# EAGLE design APM_BLE (EAGLE 7.5.0)
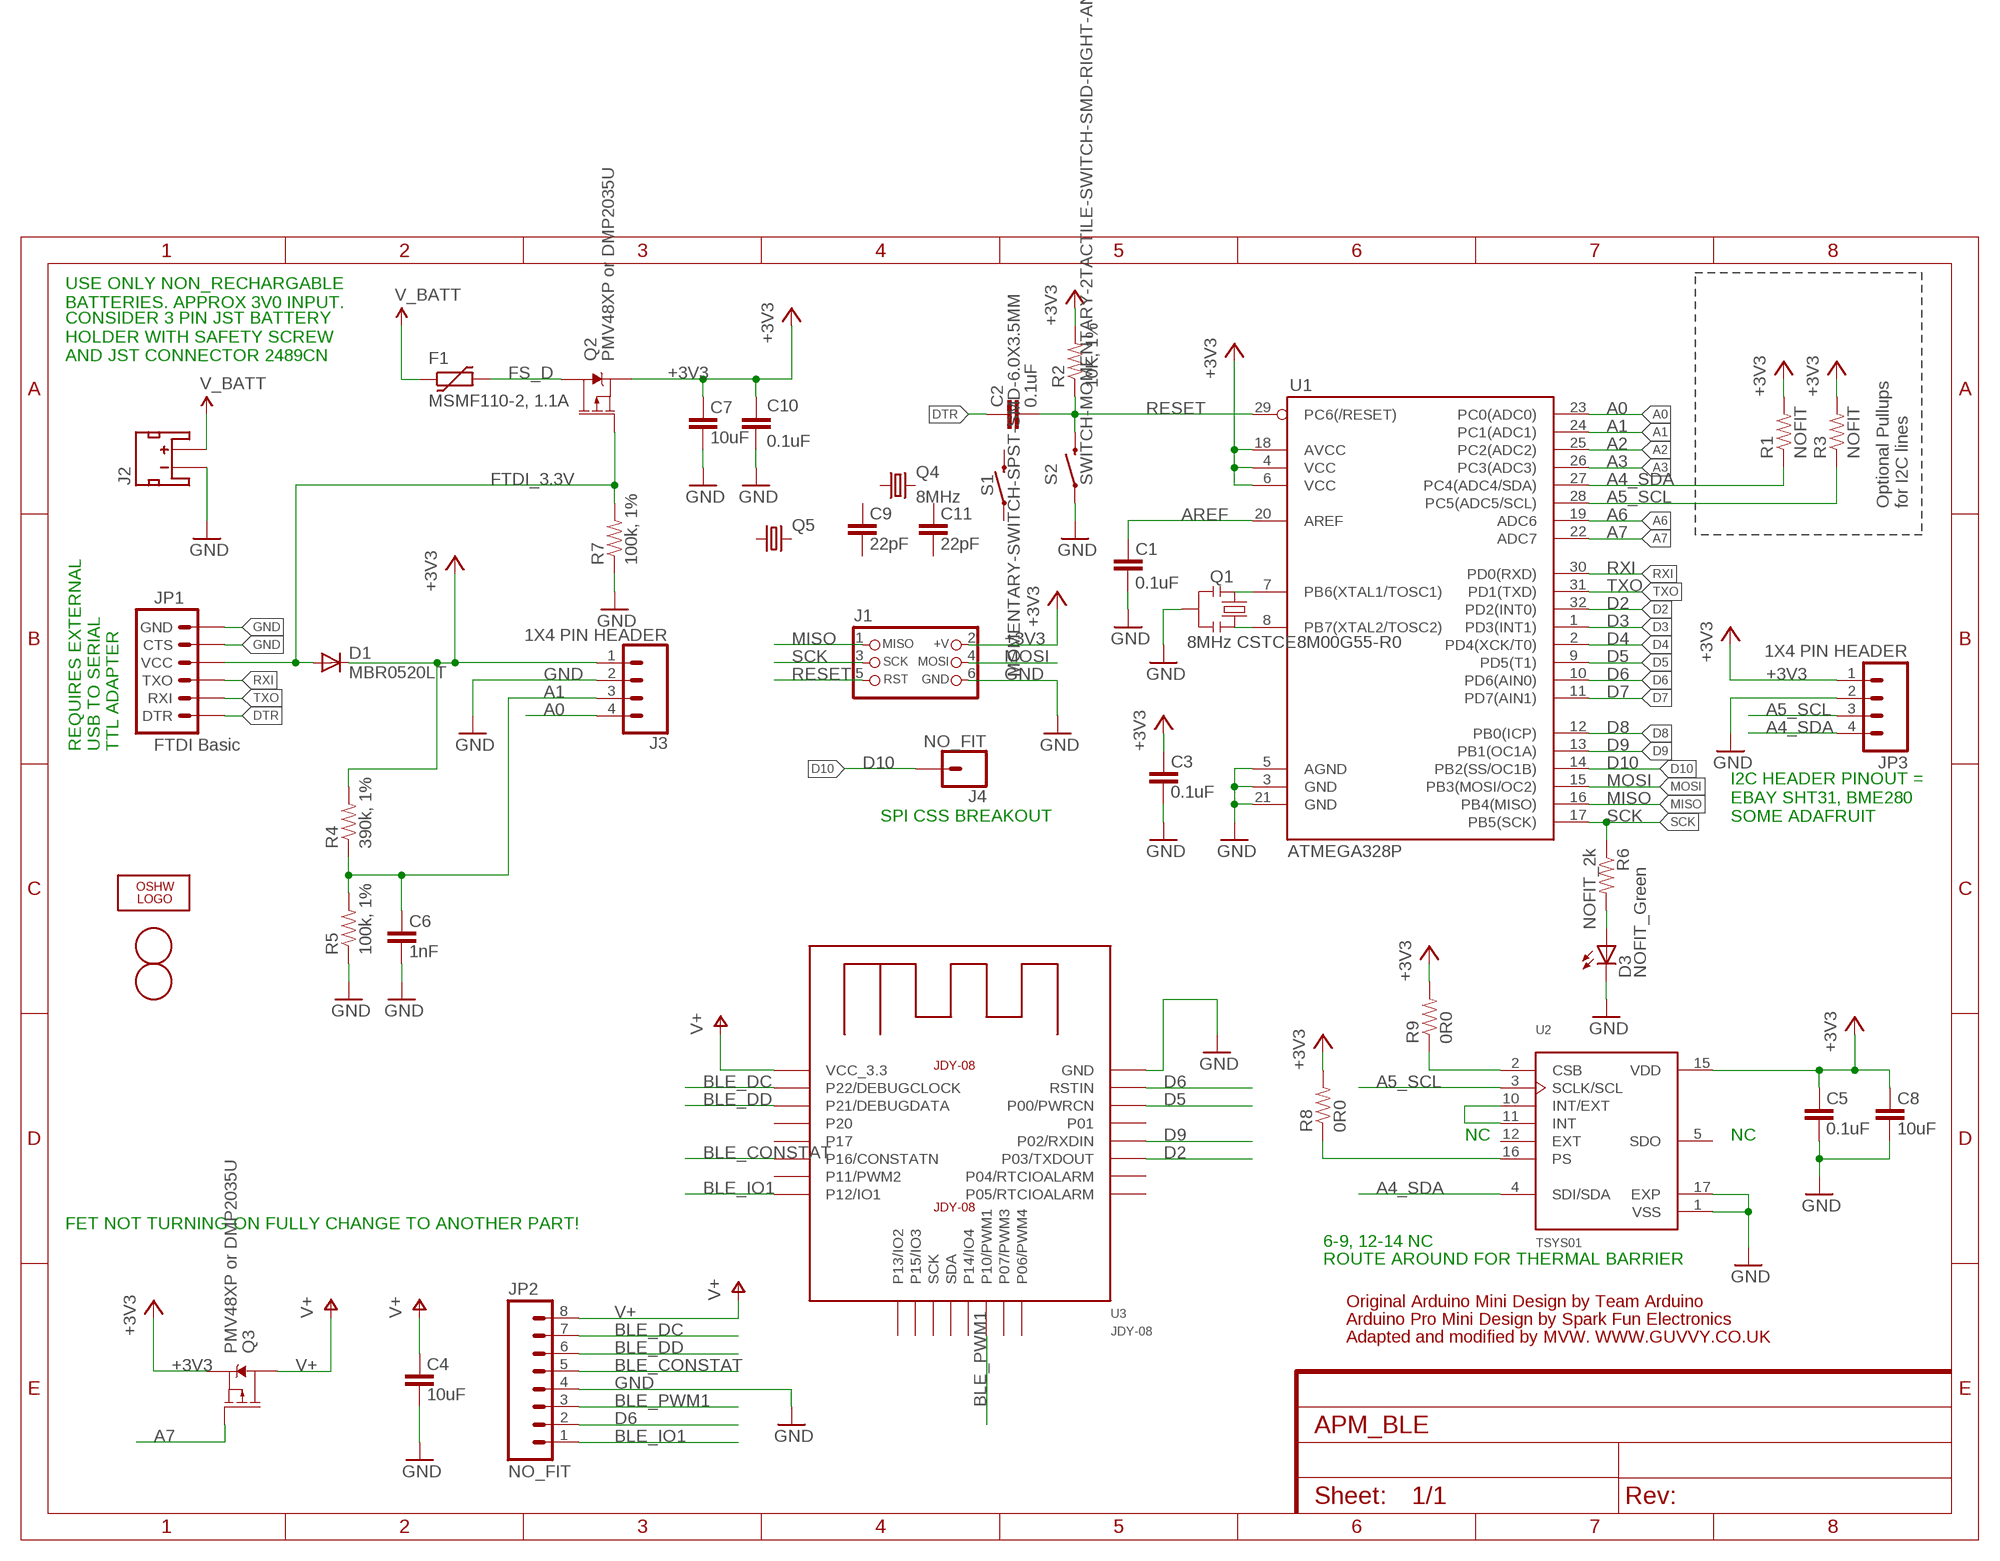
[diagram p0: schematic, sheet 1]

## Parts
C1  0.1uF  CAP0603-CAP  [0603-CAP]
C2  0.1uF  CAP0603-CAP  [0603-CAP]
C3  0.1uF  CAP0603-CAP  [0603-CAP]
C4  10uF  CAP0603-CAP  [0603-CAP]
C5  0.1uF  CAP0603-CAP  [0603-CAP]
C6  1nF  CAP0603-CAP  [0603-CAP]
C7  10uF  CAP0603-CAP  [0603-CAP]
C8  10uF  CAP0603-CAP  [0603-CAP]
C9  22pF  CAP0603-CAP  [0603-CAP]
C10  0.1uF  CAP0603-CAP  [0603-CAP]
C11  22pF  CAP0603-CAP  [0603-CAP]
D1  MBR0520LT  [SOD123]
D3  NOFIT_Green  LED  [0603-LED-ALT1]
F1  MSMF110-2, 1.1A  FUSE_PTC-1812  [PTC1812L]
FID1  FIDUCIAL  [FIDUCIAL_1MM]
FID2  FIDUCIAL  [FIDUCIAL_1MM]
J1  CON_HEADER_PRG_AVR_ICSP-PTH  [HEADER_PRG_2X03]
J2  S2B-PH-SM4-TB(LF)(SN)  JST_2MM_MALE  [JST-2-SMD]
J3  1X4 PIN HEADER  CONN_04  [1X04]
J4  NO_FIT  CONN_01  [1X01]
JP1  FTDI Basic  ARDUINO_SERIAL_PROGRAMPTH  [1X06]
JP2  NO_FIT  M08BM08B-SRSS-TB  [BM08B-SRSS-TB]
JP3  1X4 PIN HEADER  M04PTH  [1X04]
LOGO1  OSHW_LOGO_FILLX0200-NT  [OSHW_FILLX200_NOTEXT]
Q1  8MHz CSTCE8M00G55-R0  RESONATOR1:1  [RESONATOR-SMD-1:1]
Q2  PMV48XP or DMP2035U  MOSFET_PCH-IRLML2244  [SOT23-3]
Q3  PMV48XP or DMP2035U  MOSFET_PCH-IRLML2244  [SOT23-3]
Q4  8MHz  CRYSTALHC49UP  [HC49UP]
Q5  CRYSTALCTS406  [CTS406]
R1  NOFIT  RESISTOR0603-RES  [0603-RES]
R2  10K, 1%  RESISTOR0603-RES  [0603-RES]
R3  NOFIT  RESISTOR0603-RES  [0603-RES]
R4  390k, 1%  RESISTOR0603-RES  [0603-RES]
R5  100k, 1%  RESISTOR0603-RES  [0603-RES]
R6  NOFIT_2k  RESISTOR0603-RES  [0603-RES]
R7  100k, 1%  RESISTOR0603-RES  [0603-RES]
R8  0R0  RESISTOR0603-RES  [0603-RES]
R9  0R0  RESISTOR0603-RES  [0603-RES]
S1  MOMENTARY-SWITCH-SPST-SMD-6.0X3.5MM  [TACTILE_SWITCH_SMD_6.0X3.5MM]
S2  SWITCH-MOMENTARY-2TACTILE-SWITCH-SMD-RIGHT-ANGLE  [TACTILE_SWITCH-SMD-RIGHT-ANGLE]
U1  ATMEGA328P  ATMEGA168  [TQFP32-08]
U2  TSYS01  [QFN65P400X400X90-17N]
U3  JDY-08  JDY-08JDY-08_MODULE  [JDY-08]

## Nets
+3V3: C3.2 C5.2 C7.2 C8.2 C10.1 D1.C J1.2(+V) J3.1 JP3.1 Q2.2(S) Q3.2(S) R1.2 R2.2 R3.2 R4.2 R8.2 R9.2 U1.4(VCC) U1.6(VCC) U1.18(AVCC) U2.15(VDD)
A0: J3.4 U1.23(PC0(ADC0))
A1: C6.2 J3.3 R4.1 R5.2 U1.24(PC1(ADC1))
A2: U1.25(PC2(ADC2))
A3: U1.26(PC3(ADC3))
A4_SDA: JP3.4 R1.1 U1.27(PC4(ADC4/SDA)) U2.4(SDI/SDA)
A5_SCL: JP3.3 R3.1 U1.28(PC5(ADC5/SCL)) U2.3(SCLK/SCL)
A6: U1.19(ADC6)
A7: Q3.1(G) U1.22(ADC7)
AREF: C1.2 U1.20(AREF)
BLE_CONSTAT: JP2.5 U3.6(P16/CONSTATN)
BLE_DC: JP2.7 U3.2(P22/DEBUGCLOCK)
BLE_DD: JP2.6 U3.3(P21/DEBUGDATA)
BLE_IO1: JP2.1 U3.8(P12/IO1)
BLE_PWM1: JP2.3 U3.14(P10/PWM1)
D2: U1.32(PD2(INT0)) U3.19(P03/TXDOUT)
D3: U1.1(PD3(INT1))
D4: U1.2(PD4(XCK/T0))
D5: U1.9(PD5(T1)) U3.22(P00/PWRCN)
D6: JP2.2 U1.10(PD6(AIN0)) U3.23(RSTIN)
D7: U1.11(PD7(AIN1))
D8: U1.12(PB0(ICP))
D9: U1.13(PB1(OC1A)) U3.20(P02/RXDIN)
D10: J4.1 U1.14(PB2(SS/OC1B))
DTR: C2.2 JP1.1(DTR)
FS_D: F1.2 Q2.3(D)
FTDI_3.3V [vcc]: D1.A JP1.4(VCC) Q2.1(G) R7.2
GND [vcc]: C1.1 C3.1 C4.1 C5.1 C6.1 C7.1 C8.1 C10.2 D3.C J1.6(GND) J2.1(-) J3.2 JP1.5(CTS) JP1.6(GND) JP2.4 JP3.2 Q1.2 R5.1 R7.1 S2.1 U1.3(GND) U1.5(AGND) U1.21(GND) U2.1(VSS) U2.17(EXP) U3.24(GND)
MISO: J1.1(MISO) U1.16(PB4(MISO))
MOSI: J1.4(MOSI) U1.15(PB3(MOSI/OC2))
N$1: Q1.3 U1.8(PB7(XTAL2/TOSC2))
N$2: Q1.1 U1.7(PB6(XTAL1/TOSC1))
N$4: R9.1 U2.2(CSB)
N$6: U2.10(INT/EXT) U2.11(INT)
N$7: D3.A R6.2
N$10: R8.1 U2.16(PS)
RESET: C2.1 J1.5(RST) R2.1 S2.2 U1.29(PC6(/RESET))
RXI: JP1.3(TXO) U1.30(PD0(RXD))
SCK: J1.3(SCK) R6.1 U1.17(PB5(SCK))
TXO: JP1.2(RXI) U1.31(PD1(TXD))
V+: C4.2 JP2.8 Q3.3(D) U3.1(VCC_3.3)
V_BATT: F1.1 J2.2(+)
Unconnected: C9.1 C9.2 C11.1 C11.2 J2.NC1(PAD1) J2.NC2(PAD2) Q4.1 Q4.2 Q5.1 Q5.3 S1.1 S1.2 U2.5(SDO) U2.12(EXT) U3.4(P20) U3.5(P17) U3.7(P11/PWM2) U3.9(P13/IO2) U3.10(P15/IO3) U3.11(SCK) U3.12(SDA) U3.13(P14/IO4) U3.15(P07/PWM3) U3.16(P06/PWM4) U3.17(P05/RTCIOALARM) U3.18(P04/RTCIOALARM) U3.21(P01)

## Notes on the sheet
- USE ONLY NON_RECHARGABLE
  BATTERIES. APPROX 3V0 INPUT.
- CONSIDER 3 PIN JST BATTERY 
  HOLDER WITH SAFETY SCREW 
  AND JST CONNECTOR 2489CN
- Optional Pullups 
  for I2C lines
- REQUIRES EXTERNAL 
  USB TO SERIAL 
  TTL ADAPTER
- SPI CSS BREAKOUT
- I2C HEADER PINOUT = 
  EBAY SHT31, BME280
  SOME ADAFRUIT
- NC | NC
- FET NOT TURNING ON FULLY CHANGE TO ANOTHER PART!
- 6-9, 12-14 NC
- ROUTE AROUND FOR THERMAL BARRIER
- Original Arduino Mini Design by Team Arduino
- Arduino Pro Mini Design by Spark Fun Electronics
- Adapted and modified by MVW. WWW.GUVVY.CO.UK

## Library data of the parts
C1-C11 = SparkFun:CAP: Capacitor Standard 0603 ceramic capacitor, and 0.1" leaded capacitor.; OC_FARNELL: unknown
D1 = diode:MBR0520LT: SCHOTTKY BARRIER RECTIFIER Source: http://onsemi.com .. MBR0520LT1-D.pdf; OC_FARNELL: unknown
D3 = Testing:LED: LEDs Standard schematic elements and footprints for 5mm, 3mm, 1206, and 0603 sized LEDs. 5mm - Spark Fun Electronics SKU : COM-00529 (and others); OC_FARNELL: unknown
F1 = dp_devices:FUSE_PTC: Resettable PTC; MF: BOURNS; MPN: MF-MSMF110-2; OC_FARNELL: 9350330
FID1 FID2 = adafruit:FIDUCIAL: For use by pick and place machines to calibrate the vision/machine, 1mm By microbuilder.eu; OC_FARNELL: unknown
J1 = dp_devices:CON_HEADER_PRG_AVR_ICSP: 2x3 AVR ICSP programming header; OC_FARNELL: unknown
J2 = SparkFun-Connectors:JST_2MM_MALE: JST 2MM MALE RA CONNECTOR Two pin, compact surface mount connector. Commonly used as a battery input connection point. We really like the solid locking feeling and high current rating on these small connectors. We use these all the time as battery connectors. Mates to single-cell LiPo batteries. Here is the connector we sell at SparkFun: JST Right Angle Connector - White <https://www.sparkfun.com/products/8612> (PRT-08612) Datasheet <http://www.sparkfun.com/datasheets/Prototyping/Connectors/JST-Horizontal.pdf> It was used on these SparkFun products: SparkFun MOSFET Power Controller <https://www.sparkfun.com/products/11214> (PRT-11214) SparkFun Battery Babysitter - LiPo Battery Manager <https://www.sparkfun.com/products/13777> (PRT-13777) And many, many others that required a lipo battery connection.; MF: JST (JAPAN SOLDERLESS TERMINALS); MPN: S2B-PH-SM4-TB(LF)(SN); OC_FARNELL: 9492615; PROD_ID: CONN-11443; SF_ID: PRT-08612
J3 = SparkFun-Connectors:CONN_04: Multi connection point. Often used as Generic Header-pin footprint for 0.1 inch spaced/style header connections On any of the 0.1 inch spaced packages, you can populate with these: Break Away Headers - Straight <https://www.sparkfun.com/products/116> (PRT-00116) Break Away Male Headers - Right Angle <https://www.sparkfun.com/products/553> (PRT-00553) Female Headers <https://www.sparkfun.com/products/115> (PRT-00115) Break Away Headers - Machine Pin <https://www.sparkfun.com/products/117> (PRT-00117) Break Away Female Headers - Swiss Machine Pin <https://www.sparkfun.com/products/743> (PRT-00743) For SCREWTERMINALS and SPRING TERMINALS visit here: Screw Terimnals on SparkFun.com <https://www.sparkfun.com/search/results?term=Screw+Terminals> (5mm/3.5mm/2.54mm spacing) This device is also useful as a general connection point to wire up your design to another part of your project. Our various solder wires solder well into these plated through hole pads. Hook-Up Wire - Assortment (Stranded, 22 AWG) <https://www.sparkfun.com/products/11375> (PRT-11375) Hook-Up Wire - Assortment (Solid Core, 22 AWG) <https://www.sparkfun.com/products/11367> (PRT-11367) View the entire wire category on our website here <https://www.sparkfun.com/categories/141> Special notes: Molex polarized connector foot print use with SKU : PRT-08231 with associated crimp pins and housings. 1MM SMD Version SKU: PRT-10208; OC_FARNELL: unknown; PROD_ID: CONN-09696
J4 = SparkFun-Connectors:CONN_01: Single connection point. Often used as Generic Header-pin footprint for 0.1 inch spaced/style header connections On any of the 0.1 inch spaced packages, you can populate with these: Break Away Headers - Straight <https://www.sparkfun.com/products/116> (PRT-00116) Break Away Male Headers - Right Angle <https://www.sparkfun.com/products/553> (PRT-00553) Female Headers <https://www.sparkfun.com/products/115> (PRT-00115) Break Away Headers - Machine Pin <https://www.sparkfun.com/products/117> (PRT-00117) Break Away Female Headers - Swiss Machine Pin <https://www.sparkfun.com/products/743> (PRT-00743) This device is also useful as a general connection point to wire up your design to another part of your project. Our various solder wires solder well into these plated through hole pads. Hook-Up Wire - Assortment (Stranded, 22 AWG) <https://www.sparkfun.com/products/11375> (PRT-11375) Hook-Up Wire - Assortment (Solid Core, 22 AWG) <https://www.sparkfun.com/products/11367> (PRT-11367) View the entire wire category on our website here <https://www.sparkfun.com/categories/141> Special notes: SMTSO-256-ET is a "flush mount" nut for a 4-40 screw. We mostly use this on specialty testbeds; it is a nice way to connect hardware to your PCB at an adjustable hieght. Also note, the SNAP packages are for using a snappable style connector. We sell a baggie of snaps and they are also used on two LilyPad designs: Snap Assortment - 30 pack (male and female) <https://www.sparkfun.com/products/11347> (DEV-11347) LilyPad Arduino SimpleSnap <https://www.sparkfun.com/products/10941> (DEV-10941) LilyPad SimpleSnap Protoboard <https://www.sparkfun.com/products/10940> (DEV-10940); OC_FARNELL: unknown
JP1 = SparkFun:ARDUINO_SERIAL_PROGRAM; OC_FARNELL: unknown
JP2 = SparkFun-Connectors:M08: Header 8 Standard 8-pin 0.1" header. Use with straight break away headers (SKU : PRT-00116), right angle break away headers (PRT-00553), swiss pins (PRT-00743), machine pins (PRT-00117), and female headers (PRT-00115).; OC_FARNELL: unknown
JP3 = BC9VPC_ShortenedSilkScreen:M04: Header 4 Standard 4-pin 0.1" header. Use with straight break away headers (SKU : PRT-00116), right angle break away headers (PRT-00553), swiss pins (PRT-00743), machine pins (PRT-00117), and female headers (PRT-00115). Molex polarized connector foot print use with SKU : PRT-08231 with associated crimp pins and housings. 1MM SMD Version SKU: PRT-10208; OC_FARNELL: unknown
LOGO1 = ohw-logo:OSHW_LOGO_FILL; OC_FARNELL: unknown
Q1 = Testing:RESONATOR: Resonator Small SMD resonator. This is the itty bitty 10/20MHz resonators with built in caps. CSTCE10M0G55 and CSTCE20M0V53. Footprint for SMD has been used in SFE production for years, and does work okay. 1:1 is an attempt to get larger fillets on the sides so it will be easier to inspect these solders in our AOI machine. The pads have been minimized to match the actual metal under the resonator. To see this relation, it includes an image import of the bottom side of the component. Imported to scale on layer 200.; MF: MURATA; MPN: CSTCE8M00G55-R0; OC_FARNELL: 2443270
Q2 Q3 = SparkFun-DiscreteSemi:MOSFET_PCH: P-channel MOSFETs Voltage controlled devices that allow control of high current outputs. SparkFun Products: SparkFun ESP32 Thing <https://www.sparkfun.com/products/13907> SparkFun ESP8266 Thing <https://www.sparkfun.com/products/13231>; MF: DIODES INC.; MPN: DMP2035U; OC_FARNELL: 2061419; PROD_ID: TRANS-11153; VALUE: 4.3A/20V/54mΩ
Q4 = adafruit:CRYSTAL: CRYSTAL; OC_FARNELL: unknown; OC_NEWARK: unknown
Q5 = crystal:CRYSTAL: CRYSTAL; OC_FARNELL: unknown; OC_NEWARK: unknown
R1-R9 = SparkFun:RESISTOR: Resistor Basic schematic elements and footprints for 0603, 1206, and PTH resistors.; OC_FARNELL: unknown
S1 = SparkFun-Switches:MOMENTARY-SWITCH-SPST: Momentary Switch (Pushbutton) - SPST Normally-open (NO) SPST momentary switches (buttons, pushbuttons). Variants PTH-12MM - 12mm square, through-hole Momentary Pushbutton Switch - 12mm Square <https://www.sparkfun.com/products/9190> (COM-09190) PTH-6.0MM, PTH-6.0MM-KIT - 6.0mm square, through-hole Mini Pushbutton Switch <https://www.sparkfun.com/products/97> (COM-00097) KIT package intended for soldering kit's - only one side of pads' copper is exposed. PTH-RIGHT-ANGLE-KIT - Right-angle, through-hole Right Angle Tactile Button <https://www.sparkfun.com/products/10791> - Used on SparkFun BigTime Watch Kit <https://www.sparkfun.com/products/11734> SMD-12MM - 12mm square, surface-mount Tactile Button - SMD (12mm) <https://www.sparkfun.com/products/12993> (COM-12993) Used on SparkFun PicoBoard <https://www.sparkfun.com/products/11888> SMD-4.5MM - 4.5mm Square Trackball Switch Used on SparkFun Blackberry Trackballer Breakout <https://www.sparkfun.com/products/13169> SMD-4.6MMX2.8MM - 4.60mm x 2.80mm, surface mount Used on SparkFun SAMD21 Mini Breakout <https://www.sparkfun.com/products/13664> SMD-5.2MM, SMD-5.2-REDUNDANT - 5.2mm square, surface-mount Mini Pushbutton Switch - SMD <https://www.sparkfun.com/products/8720> (COM-08720) Used on Arduino Pro Mini <https://www.sparkfun.com/products/11114> REDUNDANT package connects both switch circuits together SMD-6.0X3.5MM - 6.0 x 3.5mm, surface mount Momentary Reset Switch SMD <https://www.sparkfun.com/products/8229> (COM-08229) SMD-6.2MM-TALL - 6.2mm square, surface mount Tactile Button - SMD (6mm) <https://www.sparkfun.com/products/12992> Used on SparkFun Digital Sandbox <https://www.sparkfun.com/products/12651> SMD-RIGHT-ANGLE - Right-angle, surface mount Used on SparkFun Block for Intel® Edison - Arduino <https://www.sparkfun.com/products/13036>; OC_FARNELL: unknown; PROD_ID: SWCH-00815; SF_SKU: COM-08229
S2 = SparkFun-Electromechanical:SWITCH-MOMENTARY-2: Various NO switches- pushbuttons, reed, etc; OC_FARNELL: unknown; PROD_ID: COMP-12265
U1 = SparkFun:ATMEGA168; MF: MICROCHIP; MPN: ATMEGA328P-AU; OC_FARNELL: 1715486
U2 = TSYS01:TSYS01: TSYS01 Series 3.6 V - 40 C to + 125 C SMT Digital Temperature Sensor - QFN-16; AVAILABILITY: Warning; DESCRIPTION: TSYS01 Series 3.6 V - 40 C to + 125 C SMT Digital Temperature Sensor - QFN-16; MP: TSYS01; OC_FARNELL: unknown; PACKAGE: QFN-16 TE Connectivity; PRICE: 7.86 USD
U3 = JDY-08:JDY-08: JDY-08 Bluetooth 4.0 Transceiver based on TI CC2540/CC2541; OC_FARNELL: unknown

## Net classes
0 default: width 0.203 mm
1 vcc: width 0.254 mm

## Board
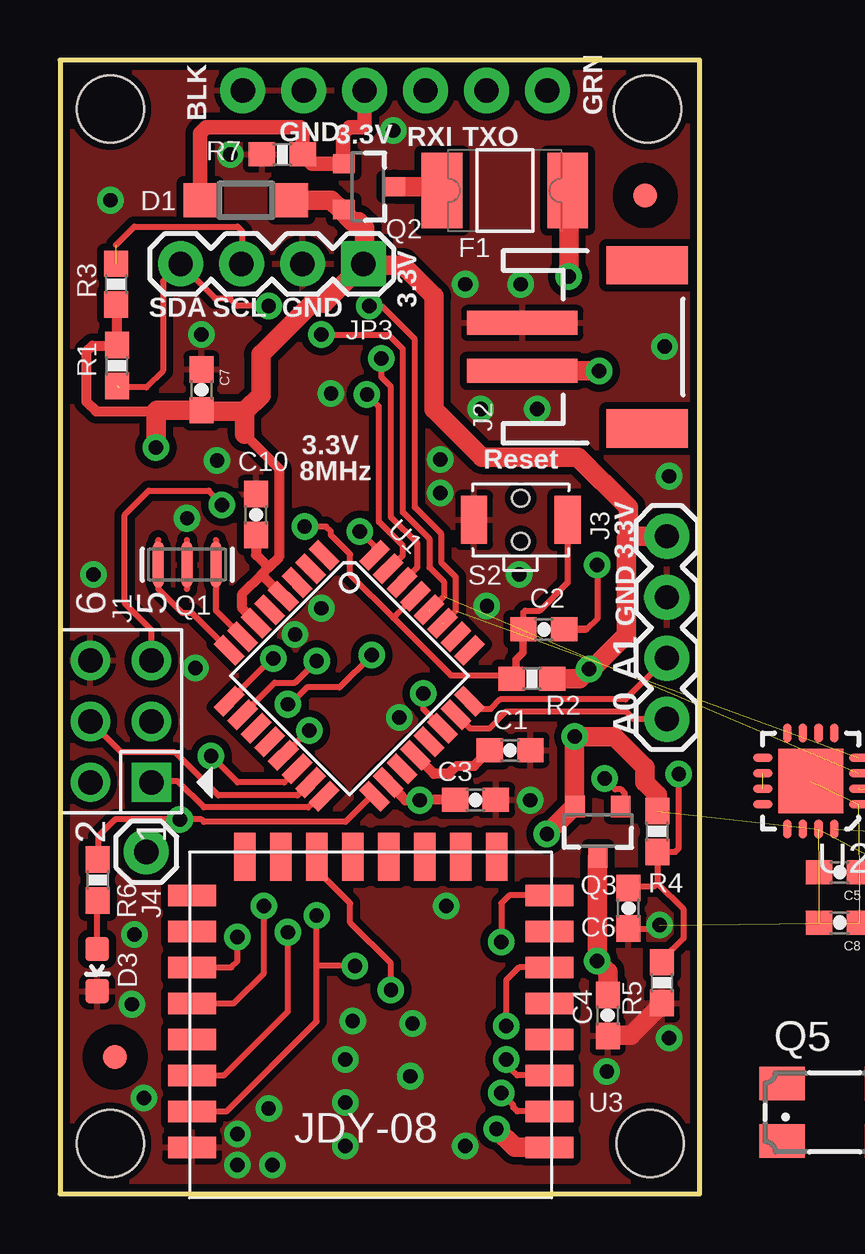
[diagram p1: board, top side]
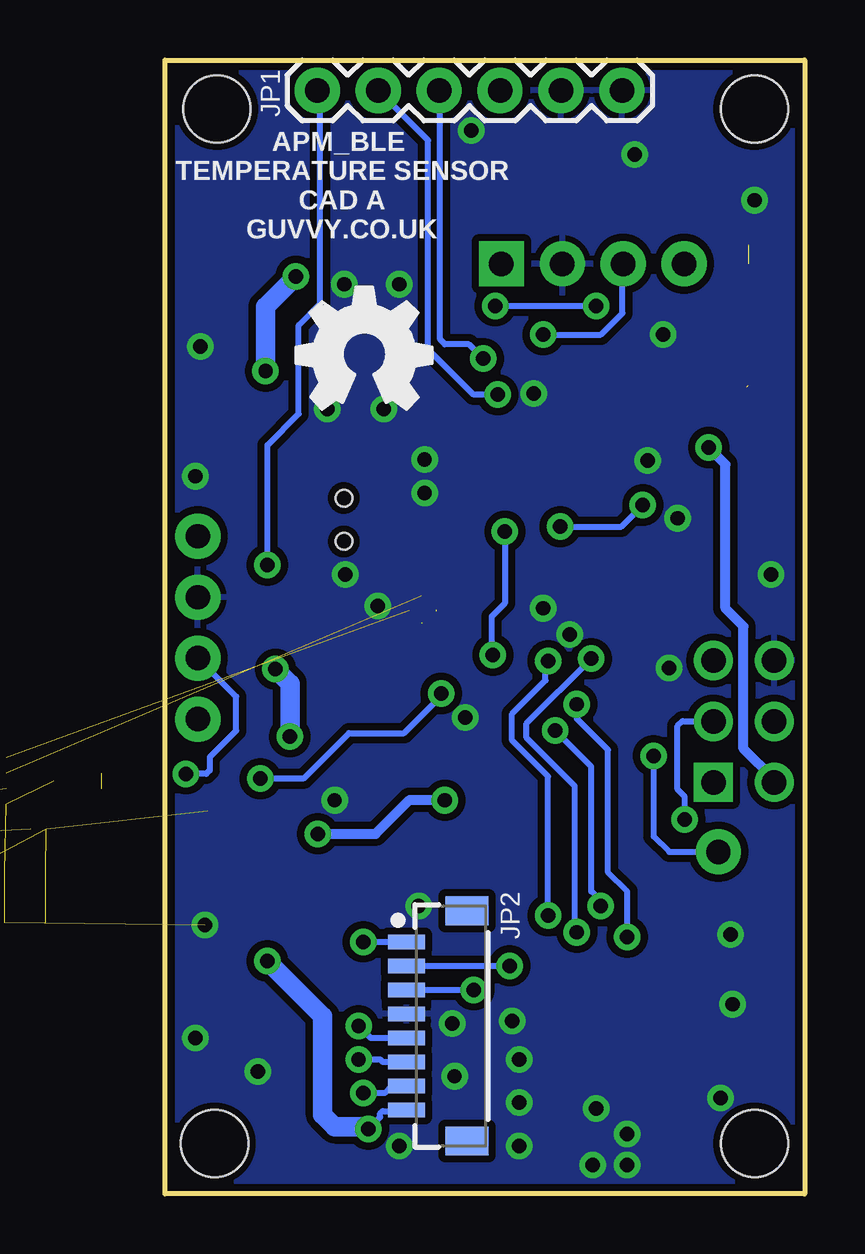
[diagram p2: board, bottom side, seen from below]

Size 26.67 x 47.24 mm. Coordinates in mm from the lower left corner, seen from the top.
Outline: 0,47.24 0,0 26.67,0 26.67,47.24 0,47.24
Copper layers (1*16): Top 0.035mm / dielectric 1.5mm / Bottom 0.035mm
Design rules "SparkFun-2-layer *": minimum track width 7mil, minimum drill 15mil, track to track 8mil, track to pad 8mil, pad to pad 8mil, via to via 8mil, smd to smd 8mil, copper to edge 8mil, drill to drill 8mil, minimum pad ring 12mil, minimum via ring 10mil, stop-mask expansion 4mil, vias tented up to drill 25mil, thermal gap 10mil
Holes 2.8 mm at 24.6,2.1 2.1,2.1 2.1,45.2 24.5,45.2

### Footprints (pad centres in the part's own frame; a part is rotated, then mirrored left to right if it is on the bottom)
0603-CAP = smd 1.1 x 1: 1 -0.85,0; 2 0.85,0
SOD123 = smd 1.4 x 1.4: A 1.9,0; C -1.9,0
0603-LED-ALT1 = smd 1 x 1: A 0,-0.877; C 0,0.877
PTC1812L = smd 1.7 x 3.15: 1 -2.62,0; 2 2.62,0
FIDUCIAL_1MM = smd 1 x 1: 1 0,0
HEADER_PRG_2X03 = drill 1.02 pad 1.632 square: 1 -2.54,-1.27 | drill 1.02 pad 1.632: 2 -2.54,1.27; 3 0,-1.27; 4 0,1.27; 5 2.54,-1.27; 6 2.54,1.27
JST-2-SMD = smd 1 x 4.6: 1 -1,-3.7; 2 1,-3.7 | smd 1.6 x 3.4: NC1 -3.4,1.5; NC2 3.4,1.5
1X04 = drill 1.016 pad 1.88: 1 0,0; 2 2.54,0; 3 5.08,0; 4 7.62,0
1X01 = drill 1.016 pad 1.88: 1 0,0
1X06 = drill 1.016 pad 1.88: 1 0,0; 2 2.54,0; 3 5.08,0; 4 7.62,0; 5 10.16,0; 6 12.7,0
BM08B-SRSS-TB = smd 0.6 x 1.55: 1 -3.5,0; 2 -2.5,0; 3 -1.5,0; 4 -0.5,0; 5 0.5,0; 6 1.5,0; 7 2.5,0; 8 3.5,0 | smd 1.2 x 1.8: P$9 4.8,2.525; P$10 -4.8,2.525
1X04' = drill 1.016 pad 1.88 square: 1 0,0 | drill 1.016 pad 1.88: 2 2.54,0; 3 5.08,0; 4 7.62,0
RESONATOR-SMD-1:1 = smd 0.45 x 1.905: 1 -1.2,0; 2 0,0; 3 1.2,0
SOT23-3 = smd 0.8 x 0.9: 1 -0.95,-1; 2 0.95,-1; 3 0,1.1
HC49UP = smd 5.334 x 1.93: 1 -4.826,0; 2 4.826,0
CTS406 = smd 1.9 x 1.4: 1 -2.2,-1.2; 2 2.2,-1.2; 3 2.2,1.2; 4 -2.2,1.2
0603-RES = smd 1.1 x 1: 1 -0.85,0; 2 0.85,0
TACTILE_SWITCH_SMD_6.0X3.5MM = smd 2.3 x 1.6: 1 -3.15,0; 2 3.15,0
TACTILE_SWITCH-SMD-RIGHT-ANGLE = smd 1.1 x 2: 1 -1.95,0; 2 1.95,0 | hole 0.7: 0,0.9; 0,-0.9
TQFP32-08 = smd 1.27 x 0.559: 1 -4.293,2.8; 2 -4.293,2; 3 -4.293,1.2; 4 -4.293,0.4; 5 -4.293,-0.4; 6 -4.293,-1.2; 7 -4.293,-2; 8 -4.293,-2.8; 17 4.293,-2.8; 18 4.293,-2; 19 4.293,-1.2; 20 4.293,-0.4; 21 4.293,0.4; 22 4.293,1.2; 23 4.293,2; 24 4.293,2.8 | smd 0.559 x 1.27: 9 -2.8,-4.293; 10 -2,-4.293; 11 -1.2,-4.293; 12 -0.4,-4.293; 13 0.4,-4.293; 14 1.2,-4.293; 15 2,-4.293; 16 2.8,-4.293; 25 2.8,4.293; 26 2,4.293; 27 1.2,4.293; 28 0.4,4.293; 29 -0.4,4.293; 30 -1.2,4.293; 31 -2,4.293; 32 -2.8,4.293
QFN65P400X400X90-17N = smd 0.8 x 0.35: 1 -2,0.975; 2 -2,0.325; 3 -2,-0.325; 4 -2,-0.975; 9 2,-0.975; 10 2,-0.325; 11 2,0.325; 12 2,0.975 | smd 0.35 x 0.8: 5 -0.975,-2; 6 -0.325,-2; 7 0.325,-2; 8 0.975,-2; 13 0.975,2; 14 0.325,2; 15 -0.325,2; 16 -0.975,2 | smd 2.7 x 2.7: 17 0,0
JDY-08 = smd 2 x 0.9: 1 -7.7,6; 2 -7.7,4.5; 3 -7.7,3; 4 -7.7,1.5; 5 -7.7,0; 6 -7.7,-1.5; 7 -7.7,-3; 8 -7.7,-4.5; 17 7.2,-4.5; 18 7.2,-3; 19 7.2,-1.5; 20 7.2,0; 21 7.2,1.5; 22 7.2,3; 23 7.2,4.5; 24 7.2,6 | smd 0.9 x 2: 9 -5.5,-6.1; 10 -4,-6.1; 11 -2.5,-6.1; 12 -1,-6.1; 13 0.5,-6.1; 14 2,-6.1; 15 3.5,-6.1; 16 5,-6.1

### Placement (x,y rotation side)
C1  18.77,18.48 180 top
C2  20.17,23.52 0 top
C3  17.32,16.42 180 top
C4  22.84,7.43 90 top
C5  32.5,13.4 180 top  (outside the outline)
C6  23.7,11.9 90 top
C7  5.9,33.5 270 top
C8  32.5,11.3 180 top  (outside the outline)
C9  40.1,2.8 0 top  (outside the outline)
C10  8.18,28.3 90 top
C11  44,3.4 0 top  (outside the outline)
D1  7.75,41.4 180 top
D3  1.56,9.32 180 top
F1  18.55,41.81 180 top
FID1  2.3,5.7 0 top
FID2  24.4,41.6 0 top
J1  2.54,19.68 90 top
J2  22.98,35.29 270 top
J3  25.3,27.4 270 top
J4  3.6,14.25 0 top
JP1  20.32,45.97 0 bottom
JP2  16.6,7 270 bottom
JP3  1X4 PIN HEADER  [1X04']  12.65,38.75 180 top
LOGO1  21.2,32.7 0 bottom
Q1  5.3,26.22 180 top
Q2  12.84,41.97 270 top
Q3  22.43,15.14 180 top
Q4  52.4,17 90 top  (outside the outline)
Q5  32.3,3.4 0 top  (outside the outline)
R1  2.38,34.51 90 top
R2  19.68,21.46 0 top
R3  2.34,37.91 270 top
R4  24.9,15.1 90 top
R5  25.1,8.8 90 top
R6  1.57,13.08 270 top
R7  9.27,43.31 0 top
R8  35.1,14.2 270 top  (outside the outline)
R9  35.1,17.5 90 top  (outside the outline)
S1  41.8,16.7 90 top  (outside the outline)
S2  19.21,28.09 0 top
U1  12.06,21.59 315 top
U2  31.3,17.2 180 top
U3  12.7,7.94 180 top

### Tracks (layer width: path | path; a pad name or v marks a point on that pad's centre or on a via)
+3V3  (via drill 0.6)  (5 unrouted)
  Top 0.406: C3.2 15.02,16.42 v15,16.4 14.4,16.4 14.2,16.6 14.2,16.63 U1.18 | U1.4 9.29,24.91 8.4,25.8 | U1.6 8.18,23.82 7.6,24.4 7.6,25 8.4,25.8 | 4,32.6 1.5,32.6 1.1,33 1.1,35.1 1.34,35.34 2.36,35.34 R1.2 2.38,36.72 R3.2 | 8.7,26.1 9.15,26.55 9.15,30.2 7.7,31.65 | 8.7,26.1 8.4,25.8 | C10.1 8.18,26.62 8.7,26.1
  Top 0.813: Q3.2 21.44,16.14 | 21.44,16.14 v20.3,15 | 7.7,32.6 8.38,33.28 8.38,34.98 10.5,37.1 11,37.1 JP3.1 | 7.7,31.65 7.7,32.6 | Q2.2 11.69,41.02 | 11.69,41.02 11.3,41.4 D1.C | 11.69,41.02 12.19,40.51 12.45,40.51 12.7,40.26 12.7,38.8 JP3.1 | 21.44,16.14 21.44,19.03 v21.46,19.05 23.11,19.05 24.38,17.78 24.38,17.14 24.9,16.63 R4.2 | R2.2 21.66,21.46 v22.06,21.86 22.18,21.86 23.62,23.31 23.62,27.32 23.7,27.4 | J3.1 23.7,27.4 | 7.7,32.6 5.95,32.6 C7.2 4.05,32.65 4,32.6 v4,31.1 | JP3.1 12.7,38.7 14.3,38.7 15.6,37.4 15.6,32.7 17.6,30.7 21.6,30.7 23.7,28.6 23.7,27.4
  Bottom 0.406: 15.4,16.4 v15,16.4 15.02,16.42 C3.2 17.89,15 v20.3,15 | J1.2 1.27,17.27 2.55,18.55 2.55,23.65 3.3,24.4 3.3,30.4 v4,31.1
  Bottom 0.813: v21.46,19.05 21.46,21.26 v22.06,21.86
A0
  Top 0.254: U1.23 16.53,19.97 17.1,19.4 17.9,19.4 18.6,20.1 23.6,20.1 23.92,19.78 J3.4
A1  (via drill 0.6)
  Top 0.254: v25.8,17.5 25.8,14.4 25.65,14.25 R4.1 24.9,12.95 | U1.24 17.41,20.2 17.95,20.2 18.35,20.6 23.58,20.6 J3.3 | 24.9,12.95 24.75,12.8 23.75,12.8 C6.2 | R5.2 25.1,9.75 26,10.65 26,11.85 24.9,12.95
  Bottom 0.254: v25.8,17.5 24.95,17.5 24.8,17.65 24.8,18.2 23.7,19.3 23.7,20.72 J3.3
A4_SDA  (via drill 0.6)  (3 unrouted)
  Top 0.254: 2.44,33.6 3.6,33.6 4.3,34.3 4.3,38.02 JP3.4 6.47,37.31 6.47,37.3 7.1,37.3 7.4,37 v8.7,37 | 15.98,23.78 16.5,24.3 16.5,25.7 15.9,26.3 15.9,27.5 14.8,28.6 14.8,35.6 13.4,37 v12.9,37
  Bottom 0.254: v12.9,37 v8.7,37
A5_SCL  (via drill 0.6)  (3 unrouted)
  Top 0.254: 15.38,24.28 16,24.9 16,25.5 15.4,26.1 15.4,27.3 14.3,28.4 14.3,35.2 13.7,35.8 v10.9,35.8 | 2.34,39.54 3.1,40.3 7.4,40.3 7.6,40.1 7.6,38.78 JP3.3
  Bottom 0.254: v10.9,35.8 8.5,35.8 7.6,36.7 7.6,38.72 JP3.3
A7  (via drill 0.6)
  Top 0.254: U1.22 | Q3.1 23.38,16.32 23.55,16.5 23.55,16.7 23.4,16.85 23.15,16.85 v22.7,17.3 | 15.95,19.35 U1.22 | U1.22 15.15,20.2 v15.15,20.85
  Bottom 0.254: v22.7,17.3 20.9,17.3 19,19.2 16.7,19.2 15.15,20.75 v15.15,20.85
AREF
  Top 0.406: U1.20 15.59,17.5 16.2,17.5 16.53,17.83 17.27,17.83 C1.2
BLE_CONSTAT  (via drill 0.6)
  Top 0.254: U3.6 19.14,9.44 18.6,8.9 v18.6,7
  Bottom 0.254: 16.7,6.6 JP2.5 18.1,6.5 v18.6,7
BLE_DC  (via drill 0.6)
  Top 0.254: U3.2 19.06,3.44 18.9,3.6 18.9,3.7 v18.4,4.2
  Bottom 0.254: JP2.7 17.2,4.5 17.5,4.2 v18.4,4.2
BLE_DD  (via drill 0.6)
  Top 0.254: U3.3 19.06,4.94 18.8,5.2 18.8,5.4 v18.6,5.6
  Bottom 0.254: v18.6,5.6 17.7,5.6 17.6,5.5 JP2.6
BLE_IO1  (via drill 0.6)
  Top 0.254: U3.8 18.74,12.44 18.4,12.1 v18.4,10.5
  Bottom 0.254: v18.4,10.5 JP2.1
BLE_PWM1  (via drill 0.6)
  Top 0.254: U3.14 10.7,13.5 12.1,12.1 12.1,11.3 13.8,9.6 v13.8,8.5
  Bottom 0.254: JP2.3 v13.8,8.5
D2  (via drill 0.6)
  Top 0.254: U3.19 7.14,9.44 7.4,9.7 v7.4,10.7 | U1.32 13.12,26.98 v12.5,27.6 | v9.5,20.4 9.6,20.4 10.3,21.1 11.65,21.1 v13,22.45
  Bottom 0.254: v7.4,10.7 7.4,12.6 8.2,13.4 8.2,18.5 9.5,19.8 v9.5,20.4 | v12.5,27.6 12.5,24.6 13.05,24.05 13.05,22.5 v13,22.45
D5  (via drill 0.6)
  Top 0.254: U3.22 6.84,4.94 9.5,7.6 v9.5,10.9 | U1.9 8.81,22.3 v8.9,22.3
  Bottom 0.254: v9.5,10.9 9.6,11 9.6,17 11.6,19 11.6,19.6 v8.9,22.3
D6  (via drill 0.6)
  Top 0.254: U3.23 6.94,3.44 10.7,7.2 10.7,9.5 | 10.7,9.5 v10.7,11.6 | v12.3,9.5 10.7,9.5 | v10.7,22.2 9.8,21.3 8.95,21.3 U1.10
  Bottom 0.254: v10.7,11.6 10.7,17.4 12.2,18.9 12.2,20 10.8,21.4 10.8,22.1 v10.7,22.2 | JP2.2 v12.3,9.5
D9  (via drill 0.6)
  Top 0.254: U3.20 7.24,7.94 8.5,9.2 v8.5,12 | v10.4,19.3 10.34,19.3 U1.13
  Bottom 0.254: v8.5,12 8.5,12.2 8.9,12.6 8.9,17.8 v10.4,19.3
D10  (via drill 0.6)
  Top 0.254: U1.14 9.88,17.68 9.35,17.15 7.4,17.15 v6.3,18.25
  Bottom 0.254: v6.3,18.25 6.3,14.9 5.65,14.25 J4.1
DTR  (via drill 0.6)
  Top 0.254: 21.91,23.52 21.96,23.52 22.42,23.97 22.42,26.18 v22.4,26.2
  Top 0.305: C2.2 21.91,23.52
  Bottom 0.254: JP1.1 20.2,45.85 20.2,37.1 21.1,36.2 21.1,32.5 22.4,31.2 v22.4,26.2
FS_D
  Top 0.813: Q2.3 15.77,41.97 F1.2
FTDI_3.3V
  Top 0.61: JP1.4 12.7,44.58 12.57,44.45 12.06,44.45 11.81,44.2 11.81,42.94 Q2.1 10.51,42.92 R7.2 10.12,44.36 10.03,44.45 6.1,44.45 5.84,44.2 D1.A
  Top 0.813: D1.A
GND  (via drill 0.6)  (4 unrouted)
  Top 0.254: C6.1 24.85,11.05 v25,11.2
  Top 0.813: R5.1 25.1,7.9 23.8,6.6 22.86,6.6 C4.1
  other vias: 6.55,30.55 5.3,28.15 10.9,24.4 19.6,16.4 9.8,23.3 14.15,19.85 25.4,29.9 19.2,37.9 25.4,6.5 5.9,35.8 7.4,1.2 3.5,4 3,7.9 7.4,2.5 8.85,1.2 11.9,2 11.9,3.8 16.9,2 22.8,5.1 14.6,4.9 12.2,7.2 16.1,12 11.9,5.6 8.7,3.55 5.65,21.91 1.4,25.8 17.8,24.5 17.55,32.7 15.85,30.6 19.9,32.7 25.2,35.3 3.1,10.8 14.7,7.1 11.3,33.35 16.9,37.9 19.15,25.8 15.85,29.2 2.1,41.4 13.9,44.3 7.1,43.3
  pour Top (isolate 0.305): 0,47.24 26.67,47.24 26.67,0 0,0
  pour Bottom (isolate 0.305): 0,47.24 26.67,47.24 26.67,0 0,0
MISO
  Top 0.254: 10.97,16.57 U1.16 10.69,16.25 10.5,16.25 10.35,16.1 6,16.1 4.9,17.2 3.87,17.2 J1.1
MOSI
  Top 0.254: U1.15 9.9,16.6 6.6,16.6 4.8,18.4 2.56,18.4 J1.4
N$1
  Top 0.254: U1.8 5.5,24.2 5.11,24.2 4.1,25.2
N$2
  Top 0.254: U1.7 7.59,23.21 6.5,24.3 6.5,25.2
N$4  (1 unrouted)
N$6  (1 unrouted)
N$7
  Top 0.254: D3.A 1.56,12.21 R6.2
N$10  (1 unrouted)
RESET  (via drill 0.6)
  Top 0.254: J1.5 3.8,22.23 3.8,23.5 2.7,24.6 2.7,28.3 3.7,29.3 6.2,29.3 6.75,28.75 v6.75,28.7 | U1.29 14.01,24.1 14,24.1 13.9,24 | 13.9,24 16.3,21.6 18.69,21.6 R2.1 18.83,21.53 19,21.7 | 13.9,24 12.1,25.8 12.1,26.65 11.3,27.45 11.3,27.6 11.1,27.8 v10.2,27.8 | C2.1 19.32,24.22 19.4,24.3 20,24.3 21.16,25.46 S2.2
  Top 0.305: 19,21.7 19,22.25 19.3,22.55 19.3,23.49 C2.1
  Bottom 0.254: v10.2,27.8 7.65,27.8 v6.75,28.7
RXI  (via drill 0.6)
  Top 0.254: U1.30 14.27,25.47 14.9,26.1 14.9,27.1 13.8,28.2 13.8,33.63 13.4,34.03 v13.4,34.8
  Bottom 0.254: v13.4,34.8 14,35.4 15,35.4 15.2,35.6 15.2,45.93 JP1.3
SCK  (via drill 0.6)
  Top 0.254: U1.17 12.97,16.57 11.9,15.5 6,15.5 5.9,15.6 v5,15.6 2.3,15.6 1.6,14.9 1.6,13.95 R6.1
  Bottom 0.254: v5,15.6 5,16.55 5.3,16.85 5.3,19.5 5.1,19.7 3.83,19.7 J1.3
TXO  (via drill 0.6)
  Top 0.254: U1.31 13.74,26.04 14.3,26.6 14.3,27 13.3,28 13.3,32.8 v12.8,33.3
  Bottom 0.254: v12.8,33.3 13.8,33.3 15.7,35.2 15.7,43.89 JP1.2
V+  (via drill 0.6)
  Top 0.813: U3.1 18.96,1.94 v18.2,2.7 | C4.2 22.84,9.26 v22.4,9.7 22.4,14.02 Q3.3
  Bottom 0.254: v18.2,2.7 17.7,3.2 17.7,3.35 17.6,3.45 16.65,3.45 JP2.8
  Bottom 0.813: v18.2,2.7 18.3,2.8 19.6,2.8 20.1,3.3 20.1,7.4 v22.4,9.7
V_BATT  (via drill 0.6)
  Top 0.813: v21.21,38.23 21.21,41.76 F1.1 | v22.48,34.29 J2.2
  Bottom 0.813: v22.48,34.29 22.48,36.96 v21.21,38.23

### Text on the board
tPlace: BLK | GRN | GND | 3.3V | RXI | TXO | SDA | SCL | GND | 3.3V | 3.3V | 8MHz | Reset | 3.3V | GND | A1 | A0
bPlace: APM_BLE / TEMPERATURE SENSOR / CAD A / GUVVY.CO.UK